# EAGLE design ni (EAGLE 9.5.2)

## Sheet 1 of 2
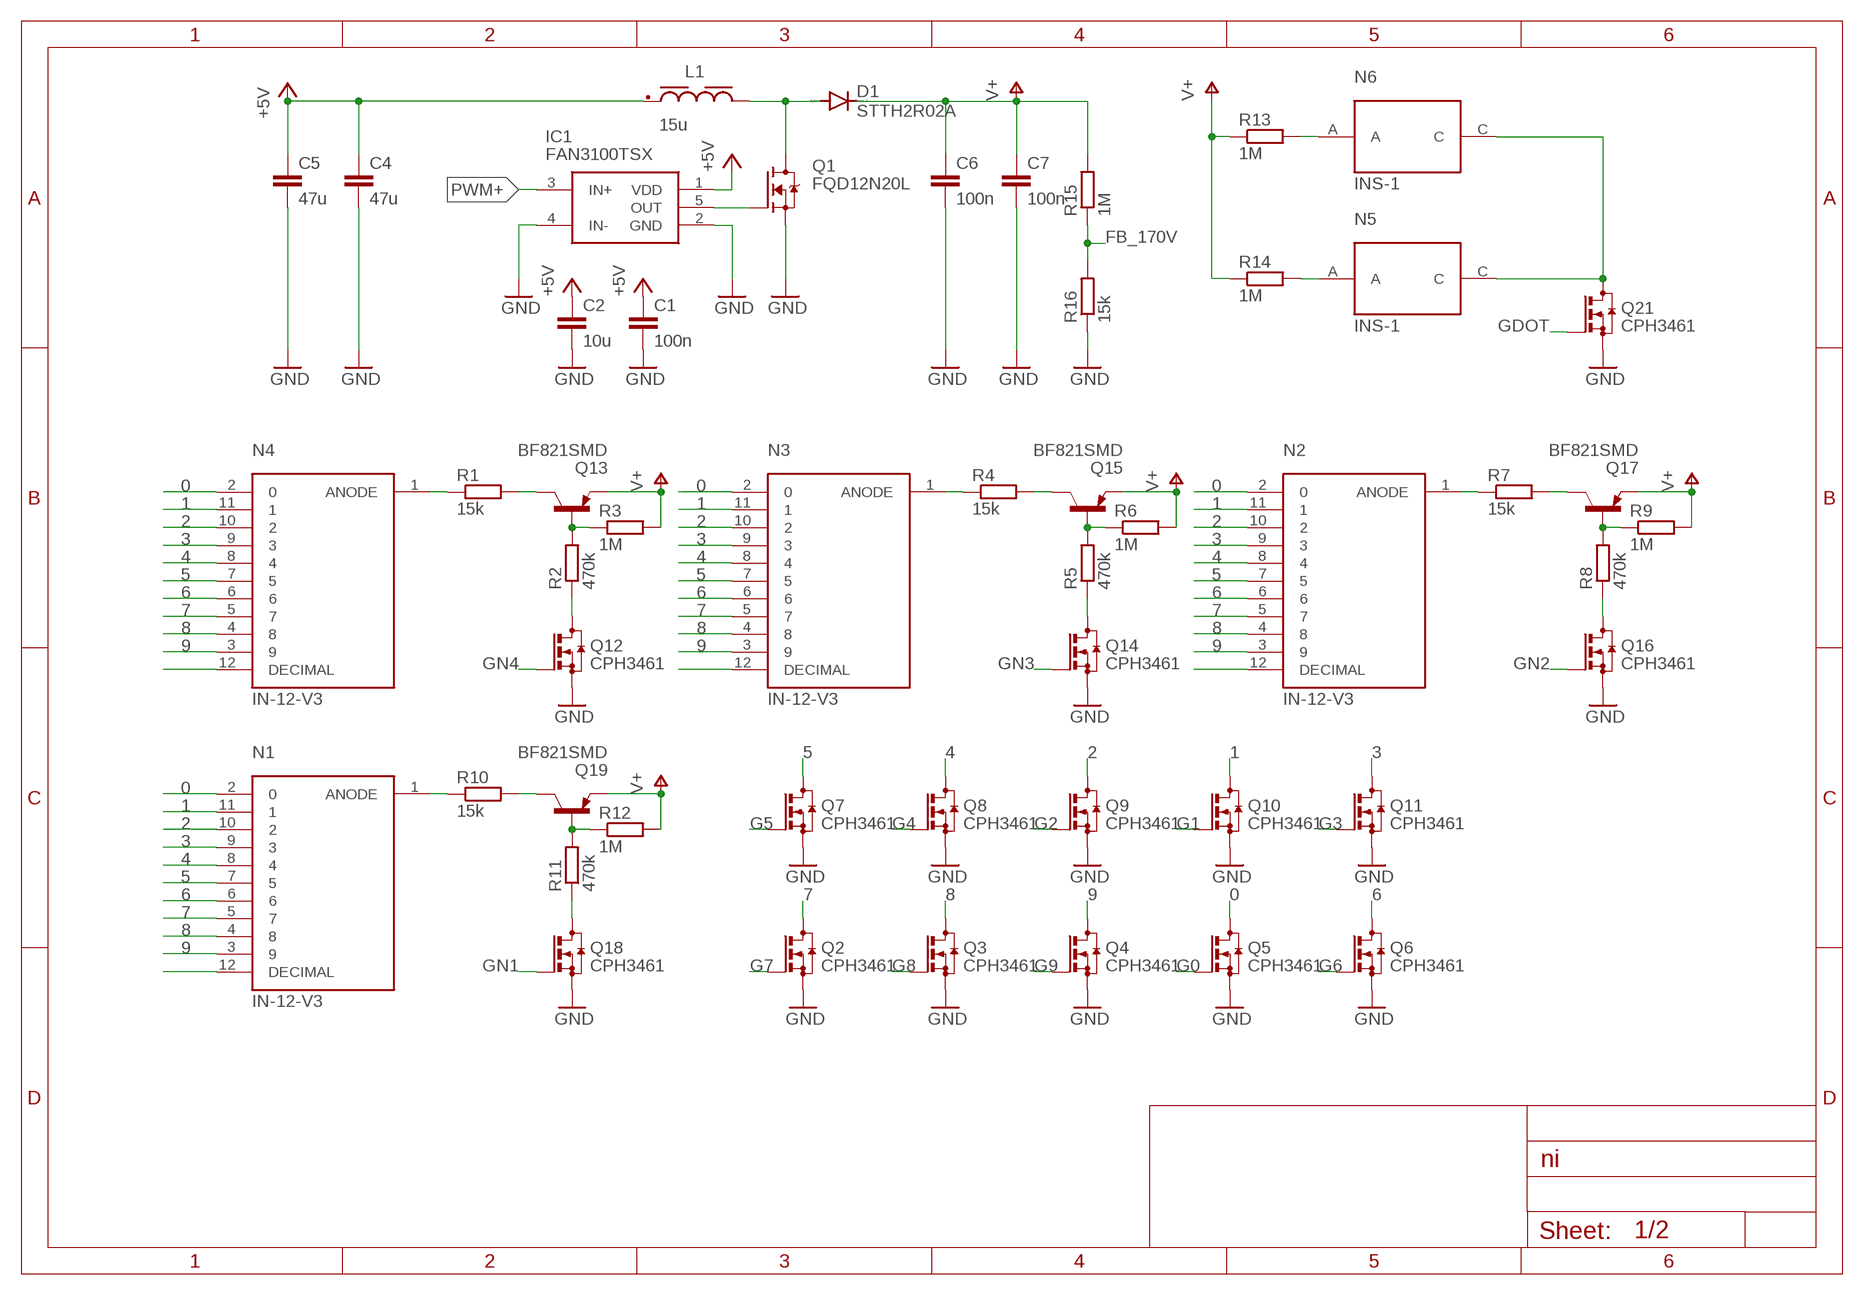
[diagram p0: schematic, sheet 1]

### Parts
C1  100n  C-EUC0402  [C0402]
C2  10u  C-EUC1206  [C1206]
C4  47u  C-EUC1206  [C1206]
C5  47u  C-EUC1206  [C1206]
C6  100n  C-EUC1812  [C1812]
C7  100n  C-EUC1812  [C1812]
D1  STTH2R02A  DIODE-DO214AC  [DO214AC]
IC1  FAN3100TSX  [SOT95P280X145-5N]
L1  15u  WE-LQS_5040_74404054150  [WE-LQS_5040]
N1  IN-12-V3  [IN-12]
N2  IN-12-V3  [IN-12]
N3  IN-12-V3  [IN-12]
N4  IN-12-V3  [IN-12]
N5  INS-1  [INS-1]
N6  INS-1  [INS-1]
Q1  FQD12N20L  [TO229P990X240-3N]
Q2  CPH3461  BSS123  [SOT23]
Q3  CPH3461  BSS123  [SOT23]
Q4  CPH3461  BSS123  [SOT23]
Q5  CPH3461  BSS123  [SOT23]
Q6  CPH3461  BSS123  [SOT23]
Q7  CPH3461  BSS123  [SOT23]
Q8  CPH3461  BSS123  [SOT23]
Q9  CPH3461  BSS123  [SOT23]
Q10  CPH3461  BSS123  [SOT23]
Q11  CPH3461  BSS123  [SOT23]
Q12  CPH3461  BSS123  [SOT23]
Q13  BF821SMD  [SOT23-BEC]
Q14  CPH3461  BSS123  [SOT23]
Q15  BF821SMD  [SOT23-BEC]
Q16  CPH3461  BSS123  [SOT23]
Q17  BF821SMD  [SOT23-BEC]
Q18  CPH3461  BSS123  [SOT23]
Q19  BF821SMD  [SOT23-BEC]
Q21  CPH3461  BSS123  [SOT23]
R1  15k  R-EU_R1206  [R1206]
R2  470k  R-EU_R1206  [R1206]
R3  1M  R-EU_R1206  [R1206]
R4  15k  R-EU_R1206  [R1206]
R5  470k  R-EU_R1206  [R1206]
R6  1M  R-EU_R1206  [R1206]
R7  15k  R-EU_R1206  [R1206]
R8  470k  R-EU_R1206  [R1206]
R9  1M  R-EU_R1206  [R1206]
R10  15k  R-EU_R1206  [R1206]
R11  470k  R-EU_R1206  [R1206]
R12  1M  R-EU_R1206  [R1206]
R13  1M  R-EU_R2010  [R2010]
R14  1M  R-EU_R2010  [R2010]
R15  1M  R-EU_R1206  [R1206]
R16  15k  R-EU_R0402  [R0402]

### Nets
0 [HV]: N1.2 N2.2 N3.2 N4.2 Q5.3(D)
1 [HV]: N1.11 N2.11 N3.11 N4.11 Q10.3(D)
2 [HV]: N1.10 N2.10 N3.10 N4.10 Q9.3(D)
3 [HV]: N1.9 N2.9 N3.9 N4.9 Q11.3(D)
4 [HV]: N1.8 N2.8 N3.8 N4.8 Q8.3(D)
5 [HV]: N1.7 N2.7 N3.7 N4.7 Q7.3(D)
6 [HV]: N1.6 N2.6 N3.6 N4.6 Q6.3(D)
7 [HV]: N1.5 N2.5 N3.5 N4.5 Q2.3(D)
8 [HV]: N1.4 N2.4 N3.4 N4.4 Q3.3(D)
9 [HV]: N1.3 N2.3 N3.3 N4.3 Q4.3(D)
+5V: C1.1 C2.1 C4.1 C5.1 IC1.1(VDD) L1.1 ; also sheet 2
FB_170V: R15.1 R16.2 ; also sheet 2
G0: Q5.1(G) ; also sheet 2
G1: Q10.1(G) ; also sheet 2
G2: Q9.1(G) ; also sheet 2
G3: Q11.1(G) ; also sheet 2
G4: Q8.1(G) ; also sheet 2
G5: Q7.1(G) ; also sheet 2
G6: Q6.1(G) ; also sheet 2
G7: Q2.1(G) ; also sheet 2
G8: Q3.1(G) ; also sheet 2
G9: Q4.1(G) ; also sheet 2
GDOT: Q21.1(G) ; also sheet 2
GN1: Q18.1(G) ; also sheet 2
GN2: Q16.1(G) ; also sheet 2
GN3: Q14.1(G) ; also sheet 2
GN4: Q12.1(G) ; also sheet 2
GND: C1.2 C2.2 C4.2 C5.2 C6.2 C7.2 IC1.2(GND) IC1.4(IN-) Q1.2(S) Q2.2(S) Q3.2(S) Q4.2(S) Q5.2(S) Q6.2(S) Q7.2(S) Q8.2(S) Q9.2(S) Q10.2(S) Q11.2(S) Q12.2(S) Q14.2(S) Q16.2(S) Q18.2(S) Q21.2(S) R16.1 ; also sheet 2
N$2 [HV]: D1.A L1.2 Q1.3(D)
N$3: IC1.5(OUT) Q1.1(G)
N$4 [HV]: N3.1(ANODE) R4.1
N$8 [HV]: N4.1(ANODE) R1.1
N$9 [HV]: Q13.C R1.2
N$10 [HV]: Q13.B R2.2 R3.1
N$11 [HV]: Q12.3(D) R2.1
N$12 [HV]: Q15.C R4.2
N$13 [HV]: N5.C N6.C Q21.3(D)
N$14 [HV]: N6.A R13.2
N$15 [HV]: Q15.B R5.2 R6.1
N$16 [HV]: Q14.3(D) R5.1
N$17 [HV]: N2.1(ANODE) R7.1
N$19 [HV]: N4.12(DECIMAL)
N$20 [HV]: N3.12(DECIMAL)
N$21 [HV]: N2.12(DECIMAL)
N$22 [HV]: N1.12(DECIMAL)
N$23 [HV]: Q17.C R7.2
N$24 [HV]: Q17.B R8.2 R9.1
N$27 [HV]: Q16.3(D) R8.1
N$29 [HV]: N1.1(ANODE) R10.1
N$30 [HV]: Q19.C R10.2
N$31 [HV]: Q19.B R11.2 R12.1
N$32 [HV]: Q18.3(D) R11.1
N$39 [HV]: N5.A R14.2
PWM+: IC1.3(IN+) ; also sheet 2
V+ [HV]: C6.1 C7.1 D1.C Q13.E Q15.E Q17.E Q19.E R3.2 R6.2 R9.2 R12.2 R13.1 R14.1 R15.2

## Sheet 2 of 2
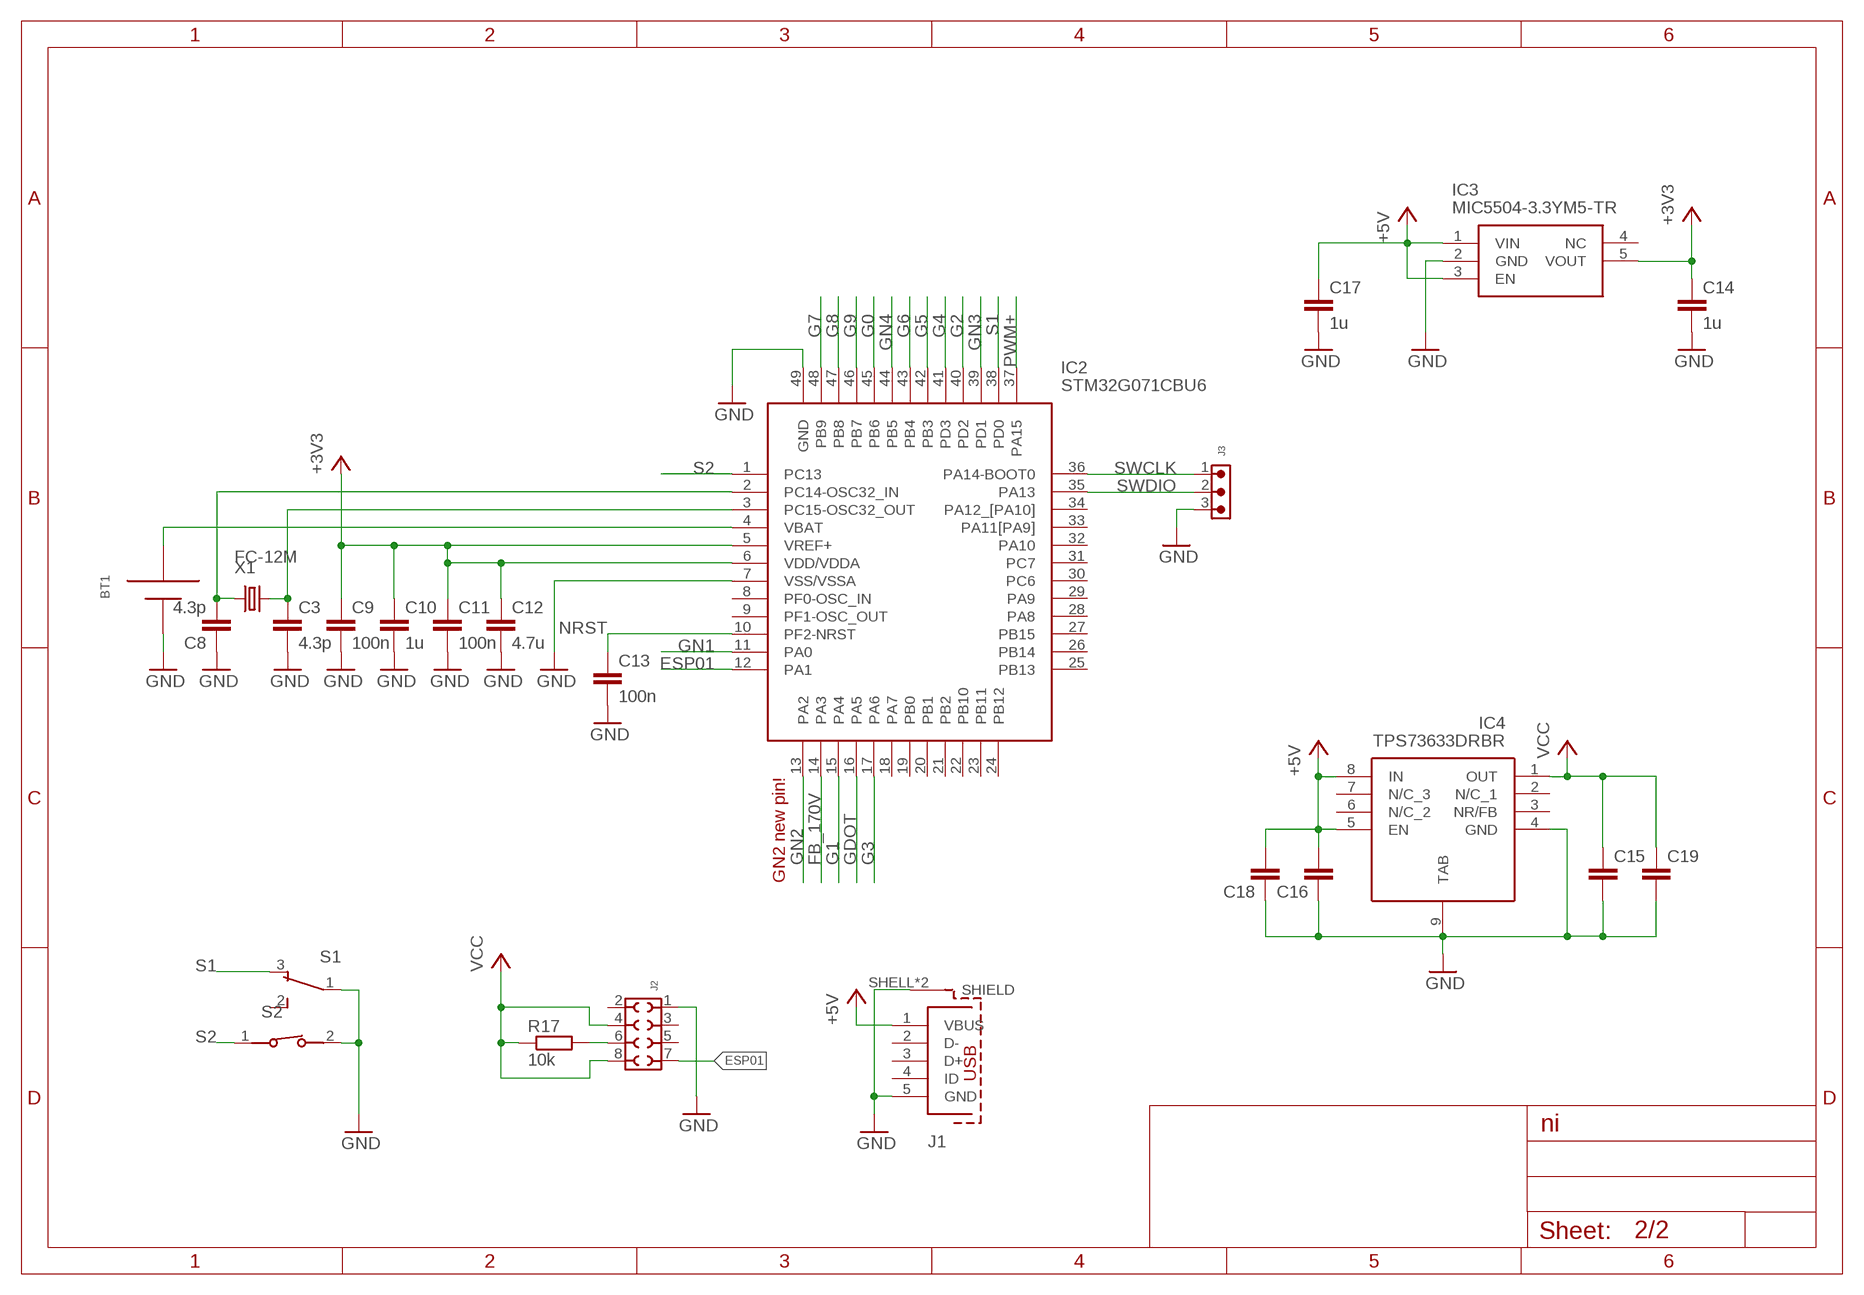
[diagram p1: schematic, sheet 2]

### Parts
BT1  CR1225FH-LF  [CR1225FH-LF]
C3  4.3p  C-EUC0402  [C0402]
C8  4.3p  C-EUC0402  [C0402]
C9  100n  C-EUC0402  [C0402]
C10  1u  C-EUC0402  [C0402]
C11  100n  C-EUC0402  [C0402]
C12  4.7u  C-EUC0402  [C0402]
C13  100n  C-EUC0402  [C0402]
C14  1u  C-EUC0402  [C0402]
C15  C-EUC1206  [C1206]
C16  C-EUC1206  [C1206]
C17  1u  C-EUC0603  [C0603]
C18  C-EUC0603  [C0603]
C19  C-EUC0603  [C0603]
IC2  STM32G071CBU6  [QFN50P700X700X60-49N]
IC3  MIC5504-3.3YM5-TR  [SOT95P280X145-5N]
IC4  TPS73633DRBR  [SON65P300X300X100-9N]
J1  614105150721  [614105150721]
J2  6100XX21821_61000821821  [61000821821]
J3  OWN_3PIN  [OWN-3PIN]
R17  10k  R-EU_R0402  [R0402]
S1  450301014042  [450301014042]
S2  434121050816  [434121050816]
X1  FC-12M  [FC-12M]

### Nets
+3V3: C9.1 C10.1 C11.1 C12.1 C14.1 IC2.5(VREF+) IC2.6(VDD/VDDA) IC3.5(VOUT)
+5V: C16.2 C17.1 C18.2 IC3.1(VIN) IC3.3(EN) IC4.5(EN) IC4.8(IN) J1.1(VBUS) ; also sheet 1
ESP01: IC2.12(PA1) J2.7
FB_170V: IC2.14(PA3) ; also sheet 1
G0: IC2.45(PB6) ; also sheet 1
G1: IC2.15(PA4) ; also sheet 1
G2: IC2.40(PD2) ; also sheet 1
G3: IC2.17(PA6) ; also sheet 1
G4: IC2.41(PD3) ; also sheet 1
G5: IC2.42(PB3) ; also sheet 1
G6: IC2.43(PB4) ; also sheet 1
G7: IC2.48(PB9) ; also sheet 1
G8: IC2.47(PB8) ; also sheet 1
G9: IC2.46(PB7) ; also sheet 1
GDOT: IC2.16(PA5) ; also sheet 1
GN1: IC2.11(PA0) ; also sheet 1
GN2: IC2.13(PA2) ; also sheet 1
GN3: IC2.39(PD1) ; also sheet 1
GN4: IC2.44(PB5) ; also sheet 1
GND: BT1.- C3.2 C8.1 C9.2 C10.2 C11.2 C12.2 C13.2 C14.2 C15.2 C16.1 C17.2 C18.1 C19.2 IC2.7(VSS/VSSA) IC2.49(GND) IC3.2(GND) IC4.4(GND) IC4.9(TAB) J1.5(GND) J1.SHELL1(SHIELD) J1.SHELL(SHIELD) J2.1 J3.3 S1.1 S2.2 ; also sheet 1
N$1: J2.6 R17.2
N$5: BT1.+ IC2.4(VBAT)
N$6: C3.1 IC2.3(PC15-OSC32_OUT) X1.2
N$7: C8.2 IC2.2(PC14-OSC32_IN) X1.1
NRST: C13.1 IC2.10(PF2-NRST)
PWM+: IC2.37(PA15) ; also sheet 1
S1: IC2.38(PD0) S1.3
S2: IC2.1(PC13) S2.1
SWCLK: IC2.36(PA14-BOOT0) J3.1
SWDIO: IC2.35(PA13) J3.2
VCC: C15.1 C19.1 IC4.1(OUT) J2.4 J2.8 R17.1
Unconnected: IC2.8(PF0-OSC_IN) IC2.9(PF1-OSC_OUT) IC2.18(PA7) IC2.19(PB0) IC2.20(PB1) IC2.21(PB2) IC2.22(PB10) IC2.23(PB11) IC2.24(PB12) IC2.25(PB13) IC2.26(PB14) IC2.27(PB15) IC2.28(PA8) IC2.29(PA9) IC2.30(PC6) IC2.31(PC7) IC2.32(PA10) IC2.33(PA11[PA9]) IC2.34(PA12_[PA10]) IC3.4(NC) IC4.2(N/C_1) IC4.3(NR/FB) IC4.6(N/C_2) IC4.7(N/C_3) J1.2(D-) J1.3(D+) J1.4(ID) J2.2 J2.3 J2.5 S1.2

### Notes on the sheet
- GN2 new pin!

## Library data of the parts
BT1 = CR1225FH-LF:CR1225FH-LF
C1-C19 = rcl:C-EU: CAPACITOR, European symbol; SPICEPREFIX: C
D1 = diode:DIODE-: DIODE
IC1 = FAN3100TSX:FAN3100TSX: FAN3100TSX, MOSFET Power Driver 3A, 4.5 to 18V, 5-Pin SOT-23 Source: Datasheet <https://www.fairchildsemi.com/datasheets/FA/FAN3100T.pdf>; DESCRIPTION: FAN3100TSX, MOSFET Power Driver 3A, 4.5 to 18V, 5-Pin SOT-23; HEIGHT: 1.45mm; MANUFACTURER_NAME: Fairchild Semiconductor; MANUFACTURER_PART_NUMBER: FAN3100TSX; MOUSER_PART_NUMBER: 512-FAN3100TSX; MOUSER_PRICE-STOCK: https://www.mouser.com/Search/Refine.aspx?Keyword=512-FAN3100TSX
IC2 = STM32G071CBU6:STM32G071CBU6: STMICROELECTRONICS - STM32G071CBU6 - MCU, 32BIT, 64MHZ, UFQFPN-48 Source: Datasheet <https://www.st.com/resource/en/datasheet/stm32g071cb.pdf>; DESCRIPTION: STMICROELECTRONICS - STM32G071CBU6 - MCU, 32BIT, 64MHZ, UFQFPN-48; HEIGHT: 0.6mm; MANUFACTURER_NAME: STMicroelectronics; MANUFACTURER_PART_NUMBER: STM32G071CBU6; MOUSER_PART_NUMBER: 511-STM32G071CBU6; MOUSER_PRICE-STOCK: https://www.mouser.com/Search/Refine.aspx?Keyword=511-STM32G071CBU6
IC3 = MIC5504-3.3YM5-TR:MIC5504-3.3YM5-TR: MICROCHIP - MIC5504-3.3YM5-TR - LDO VOLT REG, 0.3A, 3.3V, SOT-23-5 Source: Datasheet <https://componentsearchengine.com/Datasheets/2/MIC5504-3.3YM5-TR.pdf>; DESCRIPTION: MICROCHIP - MIC5504-3.3YM5-TR - LDO VOLT REG, 0.3A, 3.3V, SOT-23-5; HEIGHT: 1.45mm; MANUFACTURER_NAME: Microchip; MANUFACTURER_PART_NUMBER: MIC5504-3.3YM5-TR; MOUSER_PART_NUMBER: 998-MIC5504-3.3YM5TR; RS_PART_NUMBER: 9113332P; RS_PRICE-STOCK: http://uk.rs-online.com/web/p/products/9113332P
IC4 = TPS73633DRBR:TPS73633DRBR: Single Output LDO, 400mA, Adj.(1.2 to 5.5V), Cap free, Low Noise, Reverse Current Protection Source: Datasheet <http://www.ti.com/lit/ds/symlink/tps736.pdf>; DESCRIPTION: Single Output LDO, 400mA, Adj.(1.2 to 5.5V), Cap free, Low Noise, Reverse Current Protection; HEIGHT: 1mm; MANUFACTURER_NAME: Texas Instruments; MANUFACTURER_PART_NUMBER: TPS73633DRBR; MOUSER_PART_NUMBER: 595-TPS73633DRBR; MOUSER_PRICE-STOCK: https://www.mouser.com/Search/Refine.aspx?Keyword=595-TPS73633DRBR
J1 = Wurth_Elektronik_Electromechanic_Input-Output_Connectors_rev19b:614105150721: WR-COM_USB_Micro Type B_Vertical_THT; Micro Type B Vertical THT- Tape & Reel not for Pick & Place machine Code : Con_I-O_COM_USB_2.0_B_614105150721_614105150721 <http://katalog.we-online.de/media/images/eican/Con_I-O_COM_USB_2.0_B_614105150721_pf2.jpg> Details see: http://katalog.we-online.de/em/datasheet/614105150721.pdf Created 12/08/2014, Dan Xu 2014 (C) Wurth Elektronik
J2 = Wurth_Connectors_WR-PHD:6100XX21821_61000821821: WR-PHD 2.54mm SMT Socket Header ARTICLE PROPERTIES Pins: 4;​ 6;​ 8;​ 10;​ 12;​ 14;​ 16;​ 18;​ 20;​ 22;​ 24;​ 26;​ 28;​ 30;​ 32;​ 34;​ 36;​ 40 KIND PROPERTIES Pitch 2.54 mm Quality Class 3 as per CECC 75 301-802 Rows Dual Gender Socket Header Type Straight MATERIAL PROPERTIES Insulator Material PA9T Insulator Flammability Rating UL94 V-0 Contact Material Copper Alloy Contact Plating Gold Contact Type Stamped GENERAL INFORMATION Operating Temperature -40 up to +105 °C Compliance Lead free / RoHS ELECTRICAL PROPERTIES Rated Current 3 A;​ max. IR 1 3 A Withstanding Voltage 600 V (AC) Contact Resistance 20 mΩ RISO 1000 MΩ PACKAGING PROPERTIES Packaging Tube <https://katalog.we-online.com/media/images/v2/o33206v209%20Family_WR-PHD_610xxx21821.jpg> Details see: http://katalog.we-online.de/en/em/PHD_2_54_SMT_DUAL_SOCKET_HEADER_6100XX21821 Updated by Ella Wu 2019-06-12 2019 (C) Würth Elektronik; DATASHEET-URL: https://katalog.we-online.com/em/datasheet/61000821821.pdf; GENDER: Socket Header; IR: 3A; MATES: WR-PHD 2.54mm SMT Dual Pin Header/THT Angled Dual Pin Header/THT Dual Board Stacker/THT Dual Pin Header; PACKAGING: Tube; PART-NUMBER: 61000821821; PINS: 8; ROWS: Dual; TYPE: Straight; WE-NUMBER: 61000821821
J3 = OWN_Wurth_Connectors_WR-PHD:OWN_3PIN
L1 = Wurth_Elektronik_Passive_rev19e:WE-LQS_5040: SMD Shielded Tiny Power Inductor Characteristics Tiny Power Inductor design 1.7 times more current in comparison with unshielded versions Robust design & high durability Low RDC Magnetically shielded with magnetic glue reducing buzz noise in ultra-low levels Operating Temperature: –40 °C to +125 °C Applications Integrated DC/DC Converters Switching controllers which required high efficiency Portable power (Smartphones, digital cameras, Tablets, etc.) Embedded laptops and PCs Big sizes (5040, 60xx, 8040) used for shock-proof circuits <http://katalog.we-online.de/media/images/v2/Family_WE-LQS.jpg> Details see: http://katalog.we-online.de/en/pbs/WE-LQS Created by Dan Xu 2014-05-21 2014 (C) Wurth Elektronik; WE-NUMBER: 74404054150/15uH
N1-N4 = Nixie:IN-12
N5 N6 = Nixie:INS-1
Q1 = FQD12N20L:FQD12N20L
Q2-Q12 Q14 Q16 Q18 Q21 = transistor-small-signal:BSS123: N-CHANNEL MOS FET
Q13 Q15 Q17 Q19 = transistor-pnp:BF821*: PNP Transistror
R1-R17 = rcl:R-EU_: RESISTOR, European symbol; SPICEPREFIX: R
S1 = Wurth_Elektronik_Electromechanic_Switch_rev18c:450301014042: 10x2.5 mm THT WS-SLTV <http://katalog.we-online.de/media/images/v2/Family_WS-SLTV_THT_Mini_Slide_Switch_450301014042.jpg> Details see: http://katalog.we-online.de/en/em/SLTV_10X2_5_THT 2015 (C) Wurth Elektronik
S2 = Wurth_Elektronik_Electromechanic_Switch_rev18c:434121050816: 6.0x3.5 mm SMD WS-TASV <http://katalog.we-online.de/media/images/v2/Family_WS-TASV_6.0x3.jpg> Details see: http://katalog.we-online.de/em/datasheet/4341x1xxx8x6.pdf 2015 (C) Wurth Elektronik
X1 = crystal:FC-12M: kHz RANGE CRYSTAL UNIT LOW PROFILE SMD Source: Epson Toyocom FC-12M.pdf

## Net classes
1 HV: clearance 0.6 mm

## Board
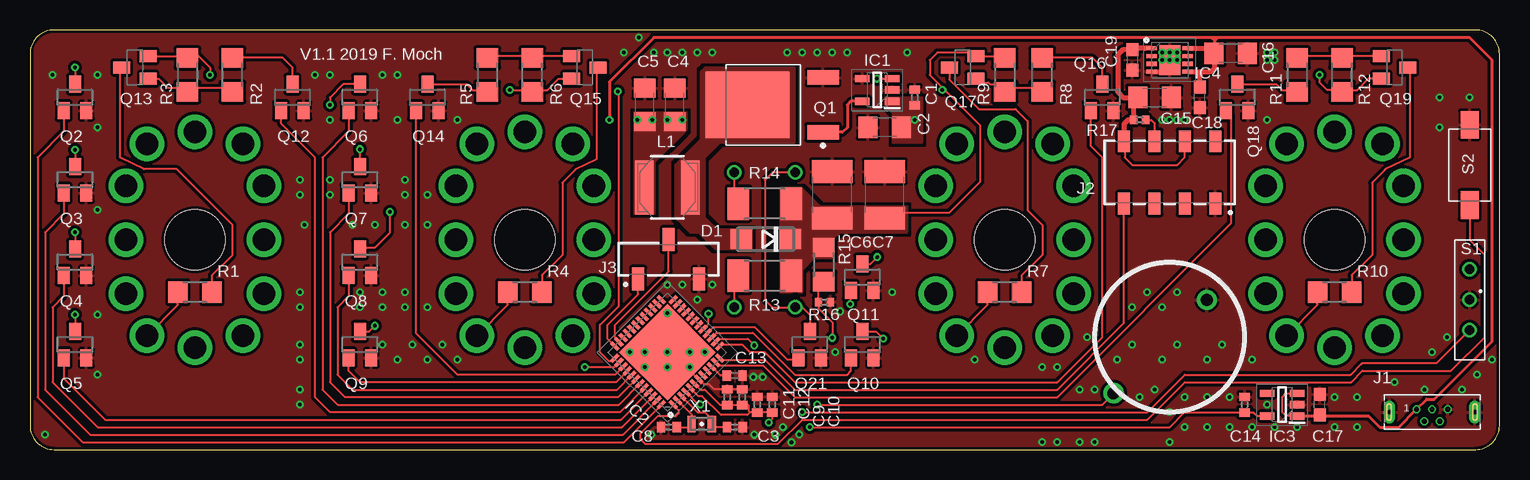
[diagram p2: board, top side]
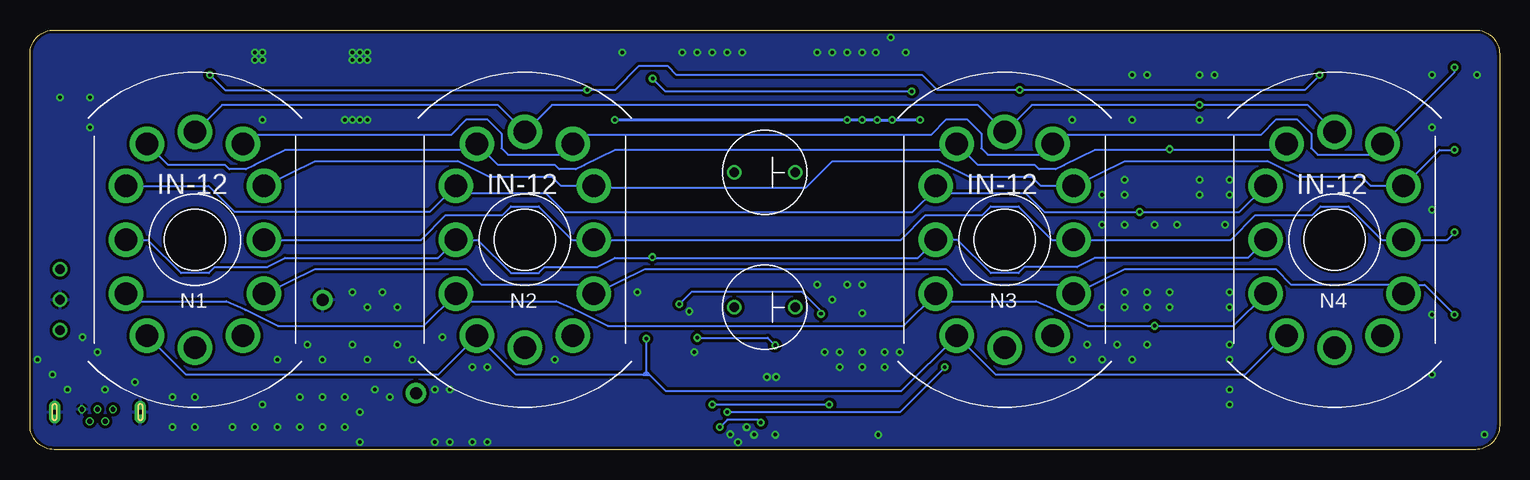
[diagram p3: board, bottom side, seen from below]

Size 122.5 x 35 mm. Coordinates in mm from the lower left corner, seen from the top.
Outline: 0,33 0,2 arc90 2,0 120.5,0 arc90 122.5,2 122.5,33 arc90 120.5,35 2,35 arc90 0,33
Copper layers (1*16): Top 0.018mm / dielectric 1.55mm / Bottom 0.018mm
Design rules "Multi-CB_2L_100um-Tracks_OL35um *": minimum track width 0.1mm, minimum drill 0.2mm, track to track 0.1mm, track to pad 0.1mm, pad to pad 0.1mm, via to via 0.1mm, smd to smd 0mil, copper to edge 0.2mm, drill to drill 0.2mm, minimum pad ring 0.125mm, minimum via ring 0.1mm, stop-mask expansion 2mil, vias tented up to drill 0.45mm, thermal gap 0.2mm

### Footprints (pad centres in the part's own frame; a part is rotated, then mirrored left to right if it is on the bottom)
CR1225FH-LF = drill 1 pad 1.676: + 6.6,0; - -4.4,0
C0402 = smd 0.7 x 0.9: 1 -0.65,0; 2 0.65,0
C1206 = smd 1.6 x 1.8: 1 -1.4,0; 2 1.4,0
C1812 = smd 1.9 x 3.4: 1 -1.95,0; 2 1.95,0
C0603 = smd 1.1 x 1: 1 -0.85,0; 2 0.85,0
DO214AC = smd 1.8 x 1.7: A 2.05,0; C -2.05,0
SOT95P280X145-5N = smd 1.2 x 0.6: 1 -1.25,0.95; 2 -1.25,0; 3 -1.25,-0.95; 4 1.25,-0.95; 5 1.25,0.95
QFN50P700X700X60-49N = smd 0.85 x 0.3: 1 -3.45,2.75; 2 -3.45,2.25; 3 -3.45,1.75; 4 -3.45,1.25; 5 -3.45,0.75; 6 -3.45,0.25; 7 -3.45,-0.25; 8 -3.45,-0.75; 9 -3.45,-1.25; 10 -3.45,-1.75; 11 -3.45,-2.25; 12 -3.45,-2.75; 25 3.45,-2.75; 26 3.45,-2.25; 27 3.45,-1.75; 28 3.45,-1.25; 29 3.45,-0.75; 30 3.45,-0.25; 31 3.45,0.25; 32 3.45,0.75; 33 3.45,1.25; 34 3.45,1.75; 35 3.45,2.25; 36 3.45,2.75 | smd 0.3 x 0.85: 13 -2.75,-3.45; 14 -2.25,-3.45; 15 -1.75,-3.45; 16 -1.25,-3.45; 17 -0.75,-3.45; 18 -0.25,-3.45; 19 0.25,-3.45; 20 0.75,-3.45; 21 1.25,-3.45; 22 1.75,-3.45; 23 2.25,-3.45; 24 2.75,-3.45; 37 2.75,3.45; 38 2.25,3.45; 39 1.75,3.45; 40 1.25,3.45; 41 0.75,3.45; 42 0.25,3.45; 43 -0.25,3.45; 44 -0.75,3.45; 45 -1.25,3.45; 46 -1.75,3.45; 47 -2.25,3.45; 48 -2.75,3.45 | smd 5.7 x 5.7: 49 0,0
SON65P300X300X100-9N = smd 0.85 x 0.35: 1 -1.5,0.975; 2 -1.5,0.325; 3 -1.5,-0.325; 4 -1.5,-0.975; 5 1.5,-0.975; 6 1.5,-0.325; 7 1.5,0.325; 8 1.5,0.975 | smd 1.75 x 2.5: 9 0,0
614105150721 = drill 0.4: 1 -1.3,0.22; 2 -0.65,-0.78; 3 0,0.22; 4 0.65,-0.78; 5 1.3,0.22 | drill 0.35 pad 0.97 long: SHELL -3.575,0; SHELL1 3.575,0
61000821821 = smd 1 x 1.8: 1 -3.81,2.6; 2 -3.81,-2.6; 3 -1.27,2.6; 4 -1.27,-2.6; 5 1.27,2.6; 6 1.27,-2.6; 7 3.81,2.6; 8 3.81,-2.6
OWN-3PIN = smd 1 x 1.91: 1 3.81,1.645; 2 1.27,-1.645; 3 -1.27,1.645
WE-LQS_5040 = smd 1.55 x 4.5: 1 -1.925,0; 2 1.925,0
IN-12 = drill 1.9 pad 2.2: 1 4,-8; 2 5.75,-4.5; 3 5.75,0; 4 5.75,4.5; 5 4,8; 6 0,9; 7 -4,8; 8 -5.75,4.5; 9 -5.75,0; 10 -5.75,-4.5; 11 -4,-8; 12 0,-9 | hole 5: 0,0
INS-1 = drill 0.8: A 0,2.54; C 0,-2.54
TO229P990X240-3N = smd 2.634 x 1.216: 1 -4.241,2.29; 2 -4.241,-2.29 | smd 7.005 x 5.544: 3 2.055,0
SOT23 = smd 1 x 1.4: 1 -0.95,-1.1; 2 0.95,-1.1; 3 0,1.1
SOT23-BEC = smd 1 x 1.4: B -0.95,-1.1; C 0,1.1; E 0.95,-1.1
R1206 = smd 1.6 x 1.803: 1 -1.422,0; 2 1.422,0
R2010 = smd 1.8 x 2.7: 1 -2.2,0; 2 2.2,0
R0402 = smd 0.6 x 0.7: 1 -0.5,0; 2 0.5,0
450301014042 = drill 0.8: 1 0,0; 2 -2.54,0; 3 2.54,0
434121050816 = smd 2.3 x 1.5: 1 -3.35,0; 2 3.35,0
FC-12M = smd 0.7 x 1.4: 1 -0.85,0; 2 0.85,0

### Placement (x,y rotation side)
BT1  95,9.38 225 top
C1  73.75,29.38 90 top
C2  71.25,26.88 180 top
C3  58.75,1.88 0 top
C4  53.75,28.75 90 top
C5  51.25,28.75 90 top
C6  66.88,21.25 90 top
C7  71.25,21.25 90 top
C8  53.25,1.88 0 top
C9  60.62,3.75 90 top
C10  61.88,3.75 90 top
C11  58.12,4.38 90 top
C12  59.38,4.38 90 top
C13  58.74,6.17 0 top
C14  101.25,3.75 90 top
C15  93.75,29.38 0 top
C16  100.08,33.04 180 top
C17  107.5,3.75 90 top
C18  97.5,29.38 90 top
C19  91.88,32.5 270 top
D1  61.33,17.56 180 top
IC1  70.62,30 180 top
IC2  53.12,8.12 135 top
IC3  104.38,3.75 180 top
IC4  95,32.5 0 top
J1  116.88,3.12 0 top
J2  95,23.12 180 top
J3  54.5,15.87 180 top
L1  53.12,21.88 0 top
N1  108.75,17.5 0 bottom
N2  81.25,17.5 0 bottom
N3  41.25,17.5 0 bottom
N4  13.75,17.5 0 bottom
N5  61.25,23.12 270 bottom
N6  61.25,11.88 270 bottom
Q1  61.88,28.75 180 top
Q2  3.75,29.38 0 top
Q3  3.75,22.5 0 top
Q4  3.75,15.62 0 top
Q5  3.75,8.75 0 top
Q6  27.5,29.38 0 top
Q7  27.5,22.5 0 top
Q8  27.5,15.62 0 top
Q9  27.5,8.75 0 top
Q10  69.38,8.75 0 top
Q11  69.38,14.38 0 top
Q12  21.88,29.38 0 top
Q13  8.75,31.88 90 top
Q14  33.12,29.38 0 top
Q15  46.25,31.88 270 top
Q16  89.38,29.38 0 top
Q17  77.74,31.88 90 top
Q18  100.62,29.38 0 top
Q19  113.75,31.88 270 top
Q21  65,8.75 0 top
R1  13.75,13.12 0 top
R2  16.88,31.25 270 top
R3  13.12,31.25 90 top
R4  41.25,13.12 0 top
R5  38.12,31.25 90 top
R6  41.88,31.25 270 top
R7  81.25,13.12 0 top
R8  84.38,31.25 270 top
R9  81.25,31.25 90 top
R10  108.75,13.12 0 top
R11  105.62,31.25 90 top
R12  109.38,31.25 270 top
R13  61.25,14.49 180 top
R14  61.25,20.51 180 top
R15  66.16,15.42 90 top
R16  66.22,12.3 180 top
R17  92.5,27.5 0 top
S1  120,12.5 270 top
S2  120,23.75 90 top
X1  56,2.13 0 top

### Tracks (layer width: path | path; a pad name or v marks a point on that pad's centre or on a via)
0  (via drill 0.3 pad 0.65)
  Top 0.152: v3.75,11.25 Q5.3
  Bottom 0.152: N4.2 8.75,13.75 | 8.75,13.75 17.34,13.75 18.65,15.05 31.25,15.05 N3.2 36.25,13.75 44.84,13.75 46.15,15.05 71.25,15.05 N2.2 76.25,13.75 84.84,13.75 86.15,15.05 98.75,15.05 N1.2 | 5.5,13 v3.75,11.25 6.25,13.75 8.75,13.75
1  (via drill 0.3 pad 0.65)
  Top 0.152: Q10.3 70.53,9.85 v71.13,9.25
  Bottom 0.152: N4.11 18,9.5 21.25,6.25 42,6.25 N3.11 49.88,4.87 69.48,4.87 70.86,6.25 | 71.4,6.25 70.86,6.25 | 71.4,6.25 82,6.25 N2.11 88.5,6.25 109.5,6.25 N1.11 | v71.13,9.25 71.13,6.52 | 71.13,6.52 70.97,6.36 | 71.13,6.52 71.29,6.36 | 71.29,6.36 71.4,6.25 | 70.86,6.25 70.97,6.36 | 70.97,6.36 71.29,6.36
2  (via drill 0.3 pad 0.65)
  Top 0.152: Q9.3 28.28,9.85 v28.75,10.32
  Bottom 0.152: N1.10 113.88,12.38 106.14,12.38 104.54,11.64 101.84,10.32 89.68,10.32 N2.10 86.38,12.38 78.64,12.38 77.04,11.64 74.34,10.32 49.68,10.32 N3.10 46.38,12.38 38.64,12.38 37.04,11.64 34.34,10.32 v28.75,10.32 22.18,10.32 N4.10
3  (via drill 0.3 pad 0.65)
  Top 0.152: Q11.3 70.05,15.47 v70.62,16.05
  Bottom 0.152: N1.9 112.68,17.5 109.9,14.72 107.6,14.72 107.11,15.21 102.71,15.21 101.25,16 88.5,16 N2.9 85.18,17.5 82.4,14.72 80.1,14.72 79.61,15.21 75.21,15.21 73.75,16 70.62,16 | 70.62,16 48.5,16 N3.9 45.18,17.5 42.4,14.72 40.1,14.72 39.61,15.21 35.21,15.21 33.75,16 21,16 N4.9 | v70.62,16.05 70.62,16
4  (via drill 0.3 pad 0.65)
  Top 0.152: Q8.3 27.65,16.88 28.75,16.88 30,18.12 v30,19.82
  Bottom 0.152: N4.8 21.68,19.82 v30,19.82 37.94,19.82 39.5,21.38 46.38,21.38 N3.8 47,21.75 48.93,19.82 77.94,19.82 79.5,21.38 86.38,21.38 N2.8 89.13,19.87 105.5,19.87 107.62,22 N1.8
5  (via drill 0.3 pad 0.65)
  Top 0.152: Q7.3 v27.5,25.05
  Bottom 0.152: 77.04,23.36 77,23.38 | 77,23.38 76.29,23.73 73.75,25 45.75,25 N3.7 43.5,23.75 38.75,23.75 38.38,23.38 37,23.38 36.29,23.73 33.75,25 27.5,25 | 77,23.38 78.38,23.38 78.75,23.75 83.5,23.75 N2.7 85.75,25 101.25,25 103.79,23.73 104.5,23.38 105.88,23.38 106.25,23.75 111,23.75 N1.7 | N4.7 18.25,25 27.5,25 | v27.5,25.05 27.5,25
6  (via drill 0.3 pad 0.65)
  Top 0.152: Q6.3 26.1,30.48 25,29.38 v25,28.75
  Bottom 0.152: N1.6 106.5,28.75 83.5,28.75 N2.6 79,28.75 43.5,28.75 N3.6 39,28.75 v25,28.75 16,28.75 N4.6
7  (via drill 0.3 pad 0.65)
  Top 0.152: v3.75,31.88 Q2.3
  Bottom 0.152: N1.5 104,26.25 87.4,26.25 86.1,27.55 84.4,27.55 83.2,26.35 83.2,25.14 82.66,24.6 78.19,24.6 77.28,25.5 N2.5 76.5,26.25 47.4,26.25 46.1,27.55 44.4,27.55 43.2,26.35 43.2,25.14 42.66,24.6 38.19,24.6 37.28,25.5 N3.5 36.5,26.25 19.9,26.25 18.6,27.55 16.9,27.55 15.7,26.35 15.7,25.14 15.16,24.6 10.69,24.6 9.79,25.5 N4.5 3.75,31.5 v3.75,31.88
8  (via drill 0.3 pad 0.65)
  Top 0.152: v3.75,25 Q3.3
  Bottom 0.152: N1.4 98.75,24.05 86.87,24.05 84.18,22.74 78.99,22.74 78.25,22 N2.4 75.38,21.88 57.8,21.88 55.62,24.05 46.87,24.05 44.18,22.74 38.99,22.74 38.25,22 N3.4 31.25,24.05 19.37,24.05 16.68,22.74 11.49,22.74 10.75,22 N4.4 5,25 v3.75,25
9  (via drill 0.3 pad 0.65)
  Top 0.152: v3.75,18.12 Q4.3
  Bottom 0.152: N1.3 89.91,17.5 87.85,19.56 83.12,19.56 82.4,20.28 80.1,20.28 77.32,17.5 N2.3 49.91,17.5 47.85,19.56 43.12,19.56 42.4,20.28 40.1,20.28 37.32,17.5 N3.3 22.41,17.5 20.35,19.56 15.62,19.56 14.9,20.28 12.6,20.28 9.82,17.5 N4.3 4.38,17.5 v3.75,18.12
+3V3  (via drill 0.3 pad 0.65)
  Top 0.152: C10.1 C9.1 60.02,3.1 | 60.02,3.1 59.8,2.88 57.61,2.88 56.03,4.45 55.74,4.45 IC2.5 | IC3.5 102.3,2.8 102,3.1 C14.1 96.22,3.1 95,1.88 v65,1.88 | C10.1 61.45,3.1 | v61.58,2.25 61.88,2.55 C10.1 | IC2.6 55.9,5 56.25,5 57.52,3.73 C11.1 C12.1 59.84,3.73 59.92,3.64 59.92,3.19 60.02,3.1
  Bottom 0.152: v61.58,2.25 61.83,2.5 64.38,2.5 v65,1.88
+5V  (via drill 0.3 pad 0.65)
  Top 0.152: 107.4,2.8 C17.1 | IC3.1 104.7,2.8 104.38,3.12 104.38,4.38 104.7,4.7 IC3.3
  Top 0.254: IC3.1 107.4,2.8 111.58,2.8 112.5,1.88 114.11,1.88 J1.1 116.43,4.2 117.05,4.2 121.88,9.02 121.88,32.5 120,34.38 99,34.38 | v48.3,27.5 48.3,30.67 52,34.38 98.5,34.38 | 99,34.38 98.75,34.38 | 98.75,34.38 98.5,34.38 | 98.75,34.38 98.75,34.12 | 98.75,32.97 98.75,34.12 | 98.5,34.38 98.75,34.12 | 98.75,34.12 99,34.38
  Top 0.406: IC4.8 98.25,33.48 C16.2 98.75,32.97 98.75,31.88 98.4,31.52 97.78,31.52 | C18.2 97.5,31.25 | IC4.5 97.22,31.52 | 97.22,31.52 97.78,31.52 | 97.5,31.25 97.22,31.52 | 97.5,31.25 97.78,31.52
  Bottom 0.254: v48.3,27.5 v50.62,27.5 v51.88,27.5 v53.12,27.5 v54.38,27.5 v73.75,27.5
  pour Top (no thermals): 71.25,29.38 71.25,28.75 71.88,28.12 71.88,25.62 74.38,25.62 74.38,29.38
  pour Top (no thermals): 54.72,28.15 54.72,26.63 54.34,26.25 52.05,23.96 52.05,19.64 50.4,19.64 50.4,28.15
ESP01
  Top 0.152: IC2.12 57.64,7.5 61.25,7.5 63.75,5 85.62,5 91.19,10.56 J2.7
FB_170V  (via drill 0.3 pad 0.65)
  Top 0.152: R15.1 65.72,13.56 R16.2 65.72,11.78 66.88,10.62 v66.88,9.32 | IC2.14 57.41,9.23 59.84,9.23 v60.38,8.68
  Bottom 0.152: v66.88,9.32 61.02,9.32 v60.38,8.68
G0
  Top 0.152: Q5.1 2.8,5.95 6.25,2.5 49.27,2.5 IC2.45
G1
  Top 0.152: IC2.15 57.22,9.75 60.25,9.75 63.75,6.25 68.12,6.25 68.42,6.55 Q10.1
G2
  Top 0.152: IC2.40 48.86,5.62 27.5,5.62 26.55,6.58 Q9.1
G3  (via drill 0.3 pad 0.65)
  Top 0.152: IC2.17 56.56,10.5 v56.56,11.32 | v68.37,12.13 68.42,12.19 Q11.1
  Bottom 0.152: v56.56,11.32 56.56,11.56 58.15,13.15 67.35,13.15 v68.37,12.13
G4
  Top 0.152: Q8.1 26.55,12.8 25.62,11.88 25.62,6.25 26.88,5 48.94,5 IC2.41
G5
  Top 0.152: IC2.42 49.02,4.38 26.25,4.38 25,5.62 25,18.12 26.55,19.68 Q7.1
G6
  Top 0.152: IC2.43 49.1,3.75 25.62,3.75 24.38,5 24.38,24.38 26.55,26.55 Q6.1
G7
  Top 0.152: Q2.1 2.8,26.55 0.62,24.38 0.62,4.38 4.38,0.62 49.51,0.62 IC2.48
G8
  Top 0.152: Q3.1 2.8,19.68 1.25,18.12 1.25,5 5,1.25 49.43,1.25 IC2.47
G9
  Top 0.152: Q4.1 2.8,12.8 1.88,11.88 1.88,5.62 5.62,1.88 49.35,1.88 IC2.46
GDOT
  Top 0.152: Q21.1 63.9,7.5 63.12,7.5 60.41,10.22 56.99,10.22 IC2.16
GN1
  Top 0.152: IC2.11 57.43,7 61.12,7 63.75,4.38 85.62,4.38 100.13,18.88 100.13,27.82 Q18.1
GN2
  Top 0.152: IC2.13 57.64,8.75 59.38,8.75 60,8.12 61.25,8.12 63.75,5.62 85.62,5.62 89.38,9.38 89.38,24.38 88.42,25.32 Q16.1
GN3
  Top 0.152: IC2.39 48.77,6.25 35.62,6.25 32.17,9.7 Q14.1
GN4
  Top 0.152: IC2.44 49.19,3.12 25,3.12 23.75,4.38 23.75,24.38 20.93,27.2 Q12.1
GND  (via drill 0.3 pad 0.65)
  Top 0.152: IC2.49 53.48,8.12 IC2.7 56.18,5.42 56.62,5.42 57.02,5.03 C11.2 C12.2 59.69,5.03
  Top 0.406: IC4.4 94.65,31.52 95,31.88
  other vias: 52,33.12 53.12,33.12 54.38,33.12 55.62,33.12 56.88,33.12 63.12,33.12 64.38,33.12 65.62,33.12 66.88,33.12 68.12,33.12 73.12,33.12 60.37,1.24 51.8,1.23 84.38,6.88 87.5,5 88.75,5 92.5,4.38 93.75,5 96.25,4.38 95,3.12 84.38,0.62 85.62,0.62 119.38,5 120.62,6.25 121.88,7.5 116.88,8.12 118.12,9.38 49.5,33.12 50.75,34.38 23.75,31.25 25,31.25 29.38,31.25 30.62,31.25 30.62,27.5 35.62,27.5 25,27.5 5.62,31.25 1.88,31.25 5.62,26.88 5.62,20 5.62,11.25 5.62,6.25 63.48,0.6 64.13,1.26 62.14,1.24 62.76,1.86 100,4.38 103.12,3.75 108.75,4.38 71.88,13.12 53.12,11.38 53.12,8.12 50,8.12 56.25,8.12 53.12,6.88 30.62,7.5 22.5,7.5 22.5,8.75 29.38,8.75 31.88,8.75 33.12,7.5 34.38,8.75 35.62,7.5 22.5,11.88 22.5,13.12 27.5,11.88 29.38,11.88 29.38,13.12 33.12,11.88 31.25,11.88 31.25,13.12 27.5,13.12 22.5,5 22.5,3.75 22.87,18.75 26.88,18.75 28.75,18.75 31.25,18.75 33.12,18.75 22.5,21.25 25,21.25 33.12,21.25 31.25,21.25 31.25,22.5 25,22.5 22.5,22.5 78.75,7.5 67.13,8.12 91.88,8.75 90.62,7.5 103.12,27.5 1.25,1.25 117.5,26.88 117.5,29.38 120,29.38 94.38,7.5 98.12,7.5 98.12,4.38 101.88,7.5 95.62,8.75 99.38,8.75 87.5,0.62 88.75,0.62 95,0.62 96.25,1.88 98.12,1.88 100,1.88 101.88,1.88 103.75,1.88 105.62,1.88 108.75,1.88 113.75,5.62 55,8.12 55,6.88 51.25,6.88 51.25,8.12 67.54,11.52 116.25,5 110.62,1.88 110.62,4.38 95,32.5 95,33.12 94.38,33.12 95.62,33.12 95.62,32.5 94.38,32.5 94.38,27.5 95,27.5 103.12,32.5 103.75,33.12 103.75,32.5 103.12,33.12 95.62,27.5 96.25,27.5 85.62,6.88 88.12,9.38 94.38,11.88 95.62,13.12 93.12,13.12 91.88,11.88 60.3,6.06 61.07,6.06 55.62,12.5 54.38,13.75 53.12,13.75 56.88,13.75
  pour Bottom (isolate 0.254, rank 6): 0,35 0,0 122.5,0 122.5,35
  pour Top (isolate 0.254, rank 6): 0,35 0,0 122.5,0 122.5,35
N$1
  Top 0.152: R17.2 93.47,27.5 93.73,27.24 J2.6
N$2
  pour Top (no thermals): 60.18,16.72 60.18,18.38 57.25,18.38 56.25,19.38 56.25,24.38 57.5,25.62 63.75,25.62 63.75,31.88 56.25,31.88 55.88,31.5 55.88,25.87 53.75,23.74 53.75,19.38 55,18.12 55.72,18.12 57.12,16.72
N$3
  Top 0.254: IC1.5 68.42,29.05 68.12,28.75 68.12,26.88 67.71,26.46 Q1.1
N$4
  Top 0.152: N3.1 39.83,12.08 R4.1
N$5  (via drill 0.3 pad 0.65)
  Top 0.152: IC2.4 55.73,3.75 v55.87,3.75 | v65.62,3.75 89.38,3.75 BT1.+
  Bottom 0.152: v55.87,3.75 v65.62,3.75
N$6
  Top 0.152: C3.1 57.1,1.88 X1.2 56.85,2.53 56.25,3.12 55.65,3.12 IC2.3
N$7
  Top 0.152: C8.2 54.89,1.88 X1.1 55.15,2.92 IC2.2
N$8
  Top 0.152: N4.1 12.33,12.08 R1.1
N$9
  Top 0.152: R1.2 15.17,14.55 16.88,16.25 16.88,18.75 12.25,23.38 9.51,23.38 7.5,24.36 7.5,31.73 Q13.C
N$10
  Top 0.152: Q13.B 10.72,30.93 11.46,30.19 11.88,30.19 12.77,30.19 | 12.77,30.19 R3.1 13.3,30 | 12.77,30.19 16.52,30.19 R2.2
N$11
  Top 0.152: Q12.3 21.88,31.88 21.08,32.67 R2.1
N$12
  Top 0.152: Q15.C 47.25,31.77 47.25,24.23 45.5,23.38 | 45.49,23.38 45.5,23.38 | 45.5,23.38 45.46,23.36 45.45,23.33 44.38,22.26 44.38,16.25 42.67,14.55 R4.2
N$13
  Top 0.152: N5.C 61.88,23.12 61.25,22.5 61.25,12.5 61.88,11.88 N6.C 64.38,11.88 65,11.25 Q21.3
N$14
  Top 0.152: N6.A 58.71,14.15 R13.2
N$15
  Top 0.152: Q15.B 43.75,32.83 42.03,32.83 | 42.03,32.83 R6.1 | 42.03,32.83 38.28,32.83 R5.2
N$16
  Top 0.152: Q14.3 36.4,30.48 36.88,30 37.95,30 R5.1
N$17
  Top 0.152: N2.1 79.83,12.08 R7.1
N$23
  Top 0.152: R7.2 82.67,14.55 84.38,16.25 84.38,18.75 83.15,19.97 83.15,27.41 82.16,28.41 79.09,28.41 76.64,30.86 Q17.C 76.66,31.86
N$24
  Top 0.152: R8.2 84.02,30.19 81.61,30.19 R9.1 80.64,30.44 80.06,30.44 79.87,30.62 79.14,30.62 Q17.B
N$27
  Top 0.152: Q16.3 89.38,31.88 88.58,32.67 R8.1
N$29
  Top 0.152: N1.1 107.33,12.08 R10.1
N$30
  Top 0.152: R10.2 110.17,14.55 111.88,16.25 111.88,22.26 112.93,23.32 113,23.38 115,24.36 115,31.73 Q19.C
N$31
  Top 0.152: Q19.B 111.25,32.83 109.53,32.83 | 109.53,32.83 R12.1 | 109.53,32.83 105.78,32.83 R11.2
N$32
  Top 0.152: Q18.3 103.9,30.48 104.38,30 105.45,30 R11.1
N$39
  Top 0.152: R14.2 58.71,20.85 N5.A
NRST
  Top 0.152: 56.83,6.92 IC2.10 57.55,6.17 C13.1 58.02,6.25
PWM+  (via drill 0.3 pad 0.65)
  Top 0.152: IC2.37 48.48,7.37 48.25,7.37 47.51,8.11 47.51,10.41 49.05,11.95 49.05,29.82 v48.99,29.87 | v70.59,30.95 IC1.3
  Bottom 0.152: v48.99,29.87 69.52,29.87 v70.59,30.95
S1  (via drill 0.3 pad 0.65)
  Top 0.152: IC2.38 48.69,6.88 v46.25,6.88 | v64.38,3.12 93.12,3.12 96.25,6.25 110.1,6.25 110.99,7.14 111.05,7.2 117.24,7.2 S1.3
  Bottom 0.152: v64.38,3.12 50,3.12 v46.25,6.88
S2
  Top 0.152: IC2.1 54.08,3.28 54.08,3.01 53.83,2.75 52.3,2.75 50.87,1.32 50.87,0.9 51.27,0.5 62.37,0.5 64.38,2.5 93.12,2.5 96.25,5.62 110.13,5.62 111.07,6.56 118.44,6.56 121.25,9.38 121.25,16.25 120,17.5 S2.1
SWCLK
  Top 0.152: IC2.36 48.12,9.24 48.12,10.39 50.69,12.95 J3.1
SWDIO
  Top 0.152: IC2.35 48.75,9.32 48.75,10.38 53.23,14.86 J3.2
V+  (via drill 0.3 pad 0.65)
  Top 0.152: Q13.E 12.63,32.83 | 12.63,32.83 R3.2 | 12.63,32.83 14.05,32.83 15,31.88 v15,31.25 | v40,30 41.7,30 | 41.7,30 R6.2 | 41.7,30 43.12,30 44.05,30.93 Q15.E | 81.1,32.83 81.55,32.83 | Q19.E 111.55,30.93 110.62,30 109.55,30 | 109.55,30 R12.2 | 109.55,30 108.12,30 107.5,30.62 v107.5,31.25 | 72.15,19.3 C7.1 71.72,19.77 76.65,19.77 79.22,22.35 79.22,27.03 76.25,30 | 76.25,30 75,31.25 75,32.5 75.62,33.12 78.12,33.12 78.42,32.83 Q17.E 81.1,32.83 | 81.1,32.83 R9.2 | v76.05,30 76.25,30
  Bottom 0.152: v15,31.25 16.25,30 v40,30 46.88,30 48.12,31.25 68.62,31.25 69.38,32 71.75,32 73.75,30 v76.05,30 106.25,30 v107.5,31.25
  pour Top (no thermals): 62.5,13.12 64.38,13.12 64.38,15 65.34,15.96 67.04,15.96 67.04,17.66 67.5,18.12 73.12,18.12 73.12,20.27 73.13,20.28 65.89,20.28 64.37,21.8 62.5,21.8
VCC
  Top 0.152: J2.8 91.25,25.66 91.25,24.38 91.88,23.75 95.62,23.75 96.27,24.39 J2.4 | 92.44,33.38 92.44,33.48 | 92.94,33.38 92.94,33.48
  Top 0.406: J2.8 91.19,27.16 91.53,27.5 R17.1 92,29.02 C15.1 91.12,29.38 90.68,29.82 90.68,32.92 91.1,33.35 C19.1 92,33.48 92.44,33.48 92.94,33.48 IC4.1

### Text on the board
tNames: V1.1 2019 F. Moch